# Altium schematic sheet Power.SchDoc
size A
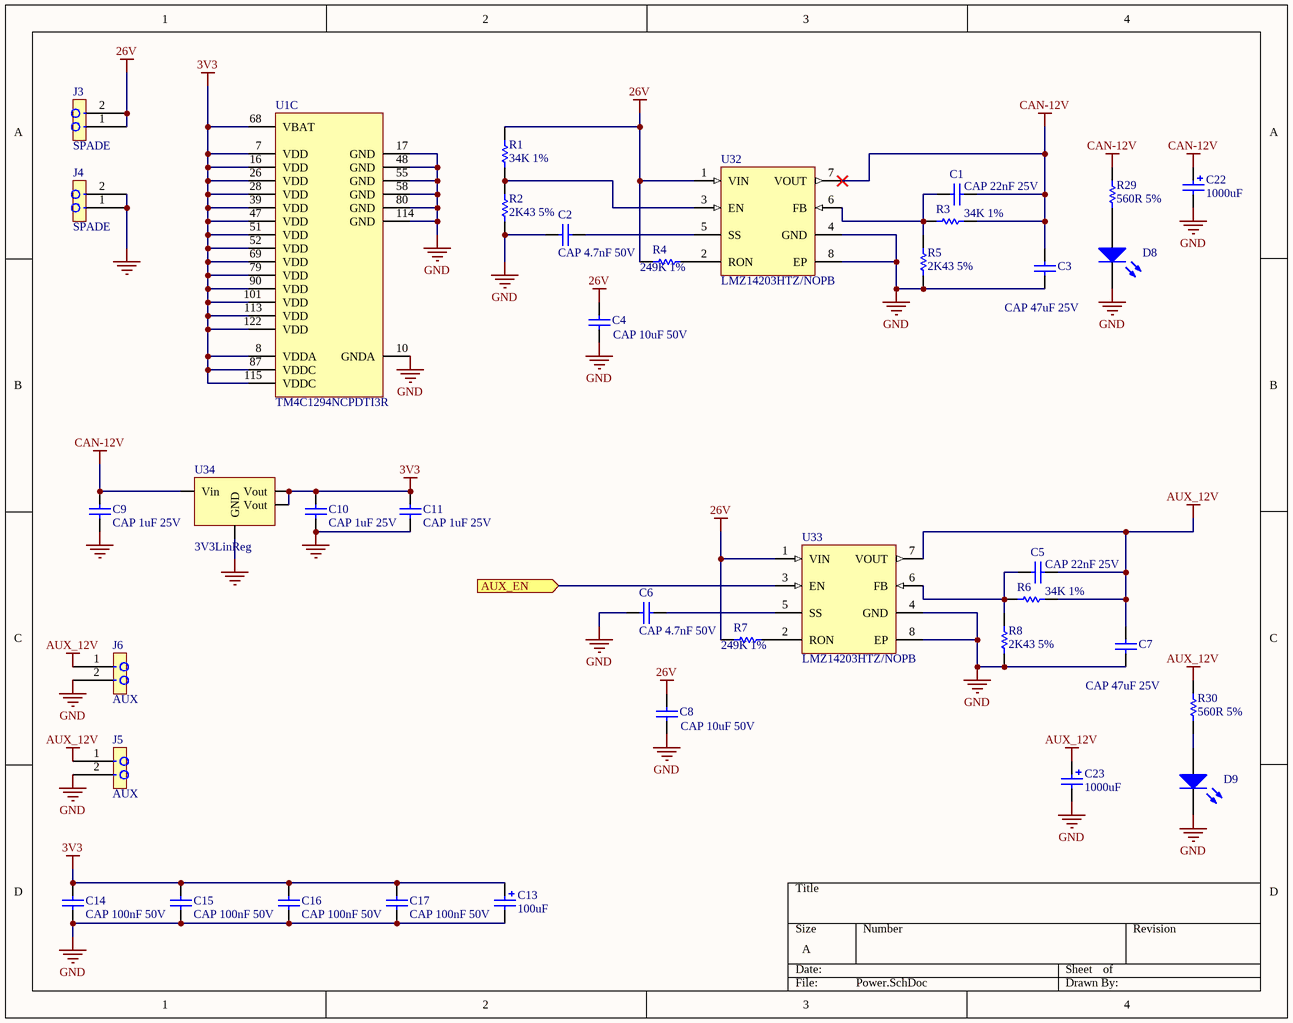
[diagram p0: Power.SchDoc]

## Parts
C1  CAP 22nF 25V  [CAPC0805(2012)100_M]
C2  CAP 4.7nF 50V  [CAPC0603(1608)100_M]
C3  CAP 47uF 25V  [CAPC1206(3216)100_L]
C4  CAP 10uF 50V  [CAPC1206(3216)190_M]
C5  CAP 22nF 25V  [CAPC0805(2012)100_M]
C6  CAP 4.7nF 50V  [CAPC0603(1608)100_M]
C7  CAP 47uF 25V  [CAPC1206(3216)100_L]
C8  CAP 10uF 50V  [CAPC1206(3216)190_M]
C9  CAP 1uF 25V  [CAPC0603(1608)100_M]
C10  CAP 1uF 25V  [CAPC0603(1608)100_M]
C11  CAP 1uF 25V  [CAPC0603(1608)100_M]
C13  100uF  [PANASONIC_C]
C14  CAP 100nF 50V  [CAPC0603(1608)100_M]
C15  CAP 100nF 50V  [CAPC0603(1608)100_M]
C16  CAP 100nF 50V  [CAPC0603(1608)100_M]
C17  CAP 100nF 50V  [CAPC0603(1608)100_M]
C22  1000uF  [PANASONIC_H13]
C23  1000uF  [PANASONIC_H13]
D8  LED  [LED-0603]  (value not drawn)
D9  LED  [LED-0603]  (value not drawn)
J3  SPADE  [SPADE-6.35-RA]
J4  SPADE  [SPADE-6.35-RA]
J5  AUX  [M5569-2]
J6  AUX  [M5569-2]
R1  34K 1%  [RESC0603(1608)_M]
R2  2K43 5%  [RESC0603(1608)_M]
R3  34K 1%  [RESC0603(1608)_M]
R4  249K 1%  [RESC0603(1608)_M]
R5  2K43 5%  [RESC0603(1608)_M]
R6  34K 1%  [RESC0603(1608)_M]
R7  249K 1%  [RESC0603(1608)_M]
R8  2K43 5%  [RESC0603(1608)_M]
R29  560R 5%  [RESC0603(1608)_M]
R30  560R 5%  [RESC0603(1608)_M]
U1  TM4C1294NCPDTI3R  [TI-PDT128_M]  (part C of 3)
U32  LMZ14203HTZ/NOPB  [TZA07A_V]
U33  LMZ14203HTZ/NOPB  [TZA07A_V]
U34  3V3LinReg  [SOT-223]

## Ports
AUX_EN (in)

## Nets
3V3: C10.2 C11.2 C13.+ C14.2 C15.2 C16.2 C17.2 U1.7(VDD) U1.8(VDDA) U1.16(VDD) U1.26(VDD) U1.28(VDD) U1.39(VDD) U1.47(VDD) U1.51(VDD) U1.52(VDD) U1.68(VBAT) U1.69(VDD) U1.79(VDD) U1.87(VDDC) U1.90(VDD) U1.101(VDD) U1.113(VDD) U1.115(VDDC) U1.122(VDD) U34.2(Vout) U34.4(Vout)
26V: C4.1 C8.1 J3.1 J3.2 R1.2 R4.1 R7.1 U32.1(VIN) U33.1(VIN)
AUX_12V: C5.2 C7.1 C23.+ J5.1 J6.1 R6.2 R30.2 U33.7(VOUT)
CAN-12V: C1.2 C3.1 C9.2 C22.+ R3.2 R29.2 U32.7(VOUT) U34.3(Vin)
GND: C2.1 C3.2 C4.2 C6.1 C7.2 C8.2 C9.1 C10.1 C11.1 C13.- C14.1 C15.1 C16.1 C17.1 C22.- C23.- D8.2(K) D9.2(K) J4.1 J4.2 J5.2 J6.2 R2.1 R5.1 R8.1 U1.10(GNDA) U1.17(GND) U1.48(GND) U1.55(GND) U1.58(GND) U1.80(GND) U1.114(GND) U32.4(GND) U32.8(EP) U33.4(GND) U33.8(EP) U34.1(GND)
AUX_EN: U33.3(EN) ; port AUX_EN
NetC1_1: C1.1 R3.1 R5.2 U32.6(FB)
NetC2_2: C2.2 U32.5(SS)
NetC5_1: C5.1 R6.1 R8.2 U33.6(FB)
NetC6_2: C6.2 U33.5(SS)
NetD8_1: D8.1(A) R29.1
NetD9_1: D9.1(A) R30.1
NetR1_1: R1.1 R2.2 U32.3(EN)
NetR4_2: R4.2 U32.2(RON)
NetR7_2: R7.2 U33.2(RON)

## Library data of the parts
C1 C5 = CMP-1036-04051-1: CAP 22nF 25V Â±5% 0805 (2012 Metric) Thickness 1mm SMD; Case-Metric: 2012; Case-EIA: 0805; Technology: SMT; Max Thickness: 1 mm; Value: 22nF; Rated Voltage: 25 V; Tolerance: Â±5%
C2 C6 = CMP-1035-00333-1: CAP 4.7nF 50V Â±20% 0603 (1608 Metric) Thickness 1mm SMD; Case-EIA: 0603; Case-Metric: 1608; Max Thickness: 1 mm; Rated Voltage: 50 V; Technology: SMT; Tolerance: Â±20%; Value: 4.7nF
C3 C7 = CMP-1037-00376-1: CAP 47uF 25V Â±0.25pF 1206 (3216 Metric) Thickness 1mm SMD; Case-EIA: 1206; Case-Metric: 3216; Technology: SMT; Max Thickness: 1 mm; Value: 47uF; Tolerance: Â±0.25pF; Rated Voltage: 25 V
C4 C8 = CMP-1037-04982-1: CAP 10uF 50V Â±10% 1206 (3216 Metric) Thickness 1.9mm SMD; Case-EIA: 1206; Case-Metric: 3216; Technology: SMT; Tolerance: Â±10%; Max Thickness: 1.9 mm; Value: 10uF; Rated Voltage: 50 V
C9-C11 = CMP-1035-00037-1: CAP 1uF 25V Â±0.25pF 0603 (1608 Metric) Thickness 1mm SMD; Case-Metric: 1608; Case-EIA: 0603; Tolerance: Â±0.25pF; Max Thickness: 1 mm; Value: 1uF; Technology: SMT; Rated Voltage: 25 V
C13 = Cap_Polarized_100uF: Polarized Capacitor (Surface Mount); Published: 8-Jun-2000; LatestRevisionDate: 29-May-2009; LatestRevisionNote: IPC-7351 Footprint Added.; PackageReference: C0805; Publisher: Altium Limited; PackageDescription: Chip Capacitor; Value: 100uF; Supplier 1: Digi-Key; Supplier 2: Mouser; Supplier Part Number 1: PCE4718CT-ND; Supplier Part Number 2: 667-EEE-HAJ101WAR
C14-C17 = CMP-1035-00010-1: CAP 100nF 50V Â±0.1pF 0603 (1608 Metric) Thickness 1mm SMD; Case-Metric: 1608; Case-EIA: 0603; Tolerance: Â±0.1pF; Technology: SMT; Value: 100nF; Max Thickness: 1 mm; Rated Voltage: 50 V
C22 C23 = Cap_Polarized_1000uF: Polarized Capacitor (Surface Mount); Published: 8-Jun-2000; LatestRevisionDate: 29-May-2009; LatestRevisionNote: IPC-7351 Footprint Added.; PackageReference: C0805; Publisher: Altium Limited; PackageDescription: Chip Capacitor; Value: 1000uF; Supplier 1: Digi-Key; Supplier 2: Mouser; Supplier Part Number 1: PCE3462CT-ND; Supplier Part Number 2: 140-VE102M1ETR1313
D8 D9 = LED: Typical RED, GREEN, YELLOW, AMBER GaAs LED; Published: 8-Jun-2000; LatestRevisionDate: 17-Jul-2002; LatestRevisionNote: Re-released for DXP Platform.; PackageVersion: Feb-2002; PackageReference: 3.2X1.6X1.1; Publisher: Altium Limited; PackageDescription: SM LED; 2 Flat Leads; Supplier 1: Digi-Key; Supplier 2: Mouser; Supplier Part Number 1: 475-1409-1-ND; Supplier Part Number 2: 720-LGQ971-KN-1
J3-J6 = CON2: 6.35mm right-angle 90° male spade terminal PCB mount; CID: 643; CID2: 643; CID3: 643
R1 R3 R6 = CMP-1012-00682-1: 34K 0.1W 1% 0603 (1608 Metric)  SMD; Value: 34000.00 Ohm; Case-EIA: 0603; Case-Metric: 1608; Tolerance: 1 %; Power: 0.1 W; Technology: SMT
R2 R5 R8 = CMP-1012-00083-1: 2K43 0.1W 5% 0603 (1608 Metric)  SMD; Value: 2430.00 Ohm; Case-Metric: 1608; Case-EIA: 0603; Tolerance: 5 %; Technology: SMT; Power: 0.1 W
R4 R7 = CMP-1012-00779-1: 249K 0.1W 1% 0603 (1608 Metric)  SMD; Case-Metric: 1608; Case-EIA: 0603; Value: 249000.00 Ohm; Technology: SMT; Power: 0.1 W; Tolerance: 1 %
R29 R30 = CMP-1012-00068-1: 560R 0.1W 5% 0603 (1608 Metric)  SMD; Case-EIA: 0603; Case-Metric: 1608; Value: 560.00 Ohm; Tolerance: 5 %; Technology: SMT; Power: 0.1 W
U1 = CMP-0945-00007-1: Tiva C Series Microcontroller, 1024 KB Flash, 256 KB SRAM, 12 Bit, 20 Channels, -40 to 85 degC, 128-Pin TQFP (PDT), Green (RoHS & no Sb/Br), Tape and Reel; Manufacturer: Texas Instruments; SRAM: 256 KB; ADC Resolution: 12 Bits; ADC Channels: 20; Flash: 1024 KB; Max Speed: 120 MHz; CPU: ARM Cortex-M4; Packing: Tape and Reel; Mounting Technology: Surface Mount; Eco-Plan: Green (RoHS & no Sb/Br); ComponentLink1URL: http://www.ti.com/; ComponentLink3Description: Package Specification; ComponentLink2Description: Datasheet; PartNumber: TM4C1294NCPDTI3R; DatasheetVersion: 15863.2743; ComponentLink1Description: Manufacturer URL; ComponentLink3URL: http://www.ti.com/lit/ml/mpqf013/mpqf013.pdf; Temperature Range: -40 to 85 degC; ComponentLink2URL: http://www.ti.com/lit/ds/symlink/tm4c1294ncpdt.pdf; PackageVersion: 4087726/A; PackageDescription: 128-Pin Thin Quad Flat Package, Body 14 x 14 mm, Pitch 0.4 mm; PartId: 2
U32 U33 = CMP-0069-02044-1: 3A SIMPLE SWITCHERÂ® Power Module with 42V Maximum Input for High Voltage Output, 7-pin TO-PMOD, Pb-Free, 250 Reel; Manufacturer: National Semiconductor; PowerWise: Y; PackageTopMarking: NSUZXYTTE#*LMZ14203*HTZ; ComponentLink3URL: http://www.national.com/packaging/folders/tza07a.html; ComponentLink2URL: http://www.national.com/pf/LM/LMZ14203H.html; ComponentLink1Description: LMZ14203 Datasheet; PackageVersion: revD, Apr-2011; RoHS: Y; DatasheetVersion: Jan-2011; PinCount: 7; CompType: Switcher; PackageDescription: TO-PMOD-7, 10.16 x 9.85 x 4.57 mm Body, 7 Lead, 1.27mm Pitch, Surface Mount; PackageReference: TZA07A; ComponentLink1URL: http://www.national.com/ds/LM/LMZ14203H.pdf; ComponentLink3Description: TZA07A Package Page; ComponentLink2Description: LMZ14203H Web Page
U34 = AZ1117EH: Reg 1A 3V3 OUT SIP VERT; Supplier 1: Digi-Key; Supplier Part Number 1: AZ1117EH-3.3TRG1DICT-ND